# Altium schematic sheet Sensors.SchDoc
size A4; SheetNumber: 8; SheetTotal: 8
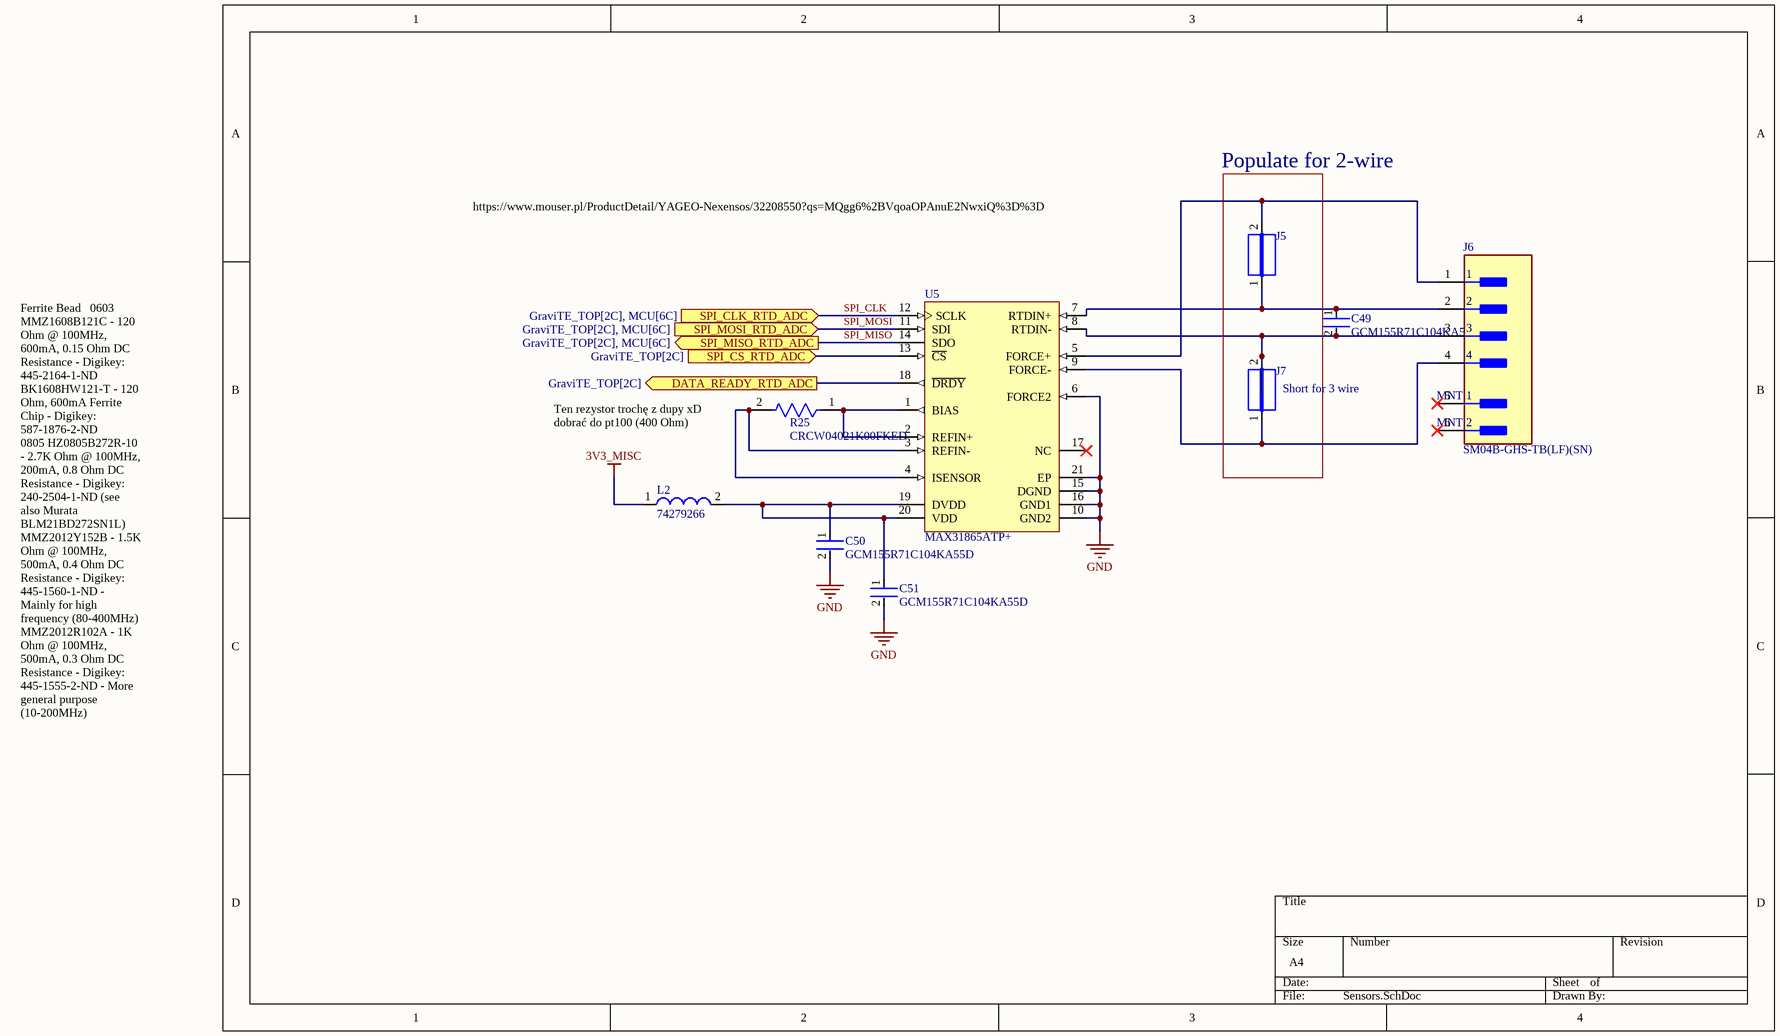
[diagram p0: Sensors.SchDoc]

## Parts
C49  GCM155R71C104KA55D  [FP-GCM155-0_05-IPC_C]
C50  GCM155R71C104KA55D  [FP-GCM155-0_05-IPC_C]
C51  GCM155R71C104KA55D  [FP-GCM155-0_05-IPC_C]
J5  JUMPER  [JUMPER]  (value not drawn)
J6  SM04B-GHS-TB(LF)(SN)  [FP-SM04B-GHS-TB_LF_SN-MFG]
J7  JUMPER  [JUMPER]  (value not drawn)
L2  74279266  [SMD-0603]
R25  CRCW04021K00FKED  [FP-CRCW0402-e3-MFG]
U5  MAX31865ATP+  [MAXM-T2055+5_L]

## Blocks framed on the sheet
Populate for 2-wire: J5 J7

## Ports
DATA_READY_RTD_ADC (out, see GraviTE_TOP[2C]), SPI_CLK_RTD_ADC (in, see GraviTE_TOP[2C], MCU[6C]), SPI_CS_RTD_ADC (in, see GraviTE_TOP[2C]), SPI_MISO_RTD_ADC (out, see GraviTE_TOP[2C], MCU[6C]), SPI_MOSI_RTD_ADC (in, see GraviTE_TOP[2C], MCU[6C])

## Nets
3V3_MISC: L2.1
GND: C50.2 C51.2 U5.6(FORCE2) U5.10(GND2) U5.15(DGND) U5.16(GND1) U5.21(EP)
DATA_READY_RTD_ADC: U5.18(~{DRDY}) ; port DATA_READY_RTD_ADC
SPI_CLK: U5.12(SCLK) ; port SPI_CLK_RTD_ADC
SPI_CS_RTD_ADC: U5.13(~{CS}) ; port SPI_CS_RTD_ADC
SPI_MISO: U5.14(SDO) ; port SPI_MISO_RTD_ADC
SPI_MOSI: U5.11(SDI) ; port SPI_MOSI_RTD_ADC
NetC49_1: C49.1 J5.1 J6.2 U5.7(RTDIN+)
NetC49_2: C49.2 J6.3 J7.2 U5.8(RTDIN-)
NetC50_1: C50.1 C51.1 L2.2 U5.19(DVDD) U5.20(VDD)
NetJ5_2: J5.2 J6.1 U5.5(FORCE+)
NetJ6_4: J6.4 J7.1 U5.9(FORCE-)
NetR25_1: R25.1 U5.1(BIAS) U5.2(REFIN+)
NetR25_2: R25.2 U5.3(REFIN-) U5.4(ISENSOR)

Not connected (* = marked no-connect by the designer): J6 5(MNT_1)* 6(MNT_2)*; U5 17(NC)*

## Notes on the sheet
- https://www.mouser.pl/ProductDetail/YAGEO-Nexensos/32208550?qs=MQgg6%2BVqoaOPAnuE2NwxiQ%3D%3D
- Ten rezystor trochę z dupy xD dobrać do pt100 (400 Ohm)
- (near J7) Short for 3 wire
- Ferrite Bead   0603 MMZ1608B121C - 120 Ohm @ 100MHz, 600mA, 0.15 Ohm DC Resistance - Digikey: 445-2164-1-ND  BK1608HW121-T - 120 Ohm, 600mA Ferrite Chip - Digikey: 587-1876-2-ND       0805 HZ0805B272R-10 - 2.7K Ohm @ 100MHz, 200mA, 0.8 Ohm DC Resistance - Digikey: 240-2504-1-ND (see also Murata BLM21BD272SN1L)  MMZ2012Y152B - 1.5K Ohm @ 100MHz, 500mA, 0.4 Ohm DC Resistance - Digikey: 445-1560-1-ND - Mainly for high frequency (80-400MHz)  MMZ2012R102A - 1K Ohm @ 100MHz, 500mA, 0.3 Ohm DC Resistance - Digikey: 445-1555-2-ND - More general purpose (10-200MHz)

## Library data of the parts
C49-C51 = CMP-2008-03711-3: Ceramic Capacitor for Automotive 100nF ±10% 16VDC X7R 0402 Paper T/R; Voltage Rating (DC): 16V; Termination: SMD/SMT; Length: 1mm; Voltage: 16V; Mount: Surface Mount; Packaging: Tape and Reel; Case Code (Metric): 1005; Case/Package: 0402; Voltage Rating: 16V; Min Operating Temperature: -55°C; Case Code (Imperial): 0402; Ratings: AEC-Q200; Height: 0.5mm; Tolerance: 10%; Width: 0.02inch; Radiation Hardening: No; Depth: 0.5mm; Capacitance: 100nF; Max Operating Temperature: 125°C; Package Quantity: 1; REACH SVHC: No SVHC; Thickness: 0.022inch; Dielectric: X7R; Lead Free: Lead Free
J5 J7 = CMP-009-00061-2: Pins: 2
J6 = CMP-17439-000411-1: CONN HEADER SMD R/A 4POS 1.25MM; Voltage Rating: 50V; Number of Contacts: 4; Current Rating: 1A; Termination: Solder; Mount: Surface Mount; REACH SVHC: No SVHC; Packaging: Cut Tape; Contact Material: Bronze; Series: GH; Orientation: Right Angle; Lead Free: Lead Free; Housing Material: Nylon; Contact Plating: Tin; Housing Color: Natural; Number of Rows: 1; Pitch: 1.25mm; Number of Positions: 4
L2 = CMP-0220-00157-1: SMD EMI Suppression Ferrite Bead WE-CBF, Z = 1000 Ohm; PackageVersion: 2009; Impedance: 1000 Ohm; PackageDescription: Chip Inductor, 2-Leads, Body 1.6 x 0.8 mm; DatasheetVersion: Dec-2005; ComponentLink2Description: Datasheet; ComponentLink1URL: http://www.we-online.com; ComponentLink1Description: Manufacturer Link; ComponentLink2URL: http://www.we-online.de/katalog/media/pdf/74279266.pdf; PackageReference: SMD-0603
R25 = CMP-2002-08276-2: RES Thick Film, 1kΩ, 1%, 0.063W, 100ppm/°C, 0402; Resistance: 1kR; Power Rating: 63mW; Voltage Rating (DC): 50V; Package Quantity: 10; Termination: SMD/SMT; Width: 0.5mm; Military Standard: Not; Length: 1mm; Contact Plating: Tin; Mount: Surface Mount; Packaging: Tape and Reel; Case Code (Imperial): 0402; Tolerance: 1%; Weight: 2.3E-05oz; Number of Pins: 2; Case/Package: 0402; Case Code (Metric): 1005; Lead Free: Lead Free; Number of Terminations: 2; Max Power Dissipation: 63mW; Depth: 0.5mm; Temperature Coefficient: 100ppm/°C; Max Operating Temperature: 155°C; Height: 0.35mm; Features: Automotive AEC-Q200; Composition: Thick Film; Radiation Hardening: No; Voltage Rating: 50V; Min Operating Temperature: -55°C
U5 = CMP-0253-00509-1: RTD-to-Digital Converter, 15 Bits Temperature Resolution, -40 to 125 degC, 20-Pin QFN (T2055+5), Pb-Free; Interface: SPI; Parasite Pwr.: No; PackageDescription: 20-Pin Thin Quad Flatpack, No Leads, Body 5 x 5 mm, Pitch 0.65 mm; ComponentLink2Description: Datasheet; Code_JEDEC: MO-220; ComponentLink3Description: Package Specification; Generic Part Number: MAX31865; ComponentLink3URL: http://pdfserv.maximintegrated.com/package_dwgs/21-0140.PDF; ComponentLink2URL: http://datasheets.maximintegrated.com/en/ds/MAX31865.pdf; Mounting Technology: Surface Mount; PartNumber: MAX31865ATP+; PackageVersion: Rev. Q, 09/2011; DatasheetVersion: Rev. 0; PackageReference: T2055+5; ComponentLink1URL: http://www.maximintegrated.com/; ComponentLink1Description: Manufacturer URL; Functions: RTD-to-Digital Converter